# Altium schematic sheet Remote-control.SchDoc
size A4
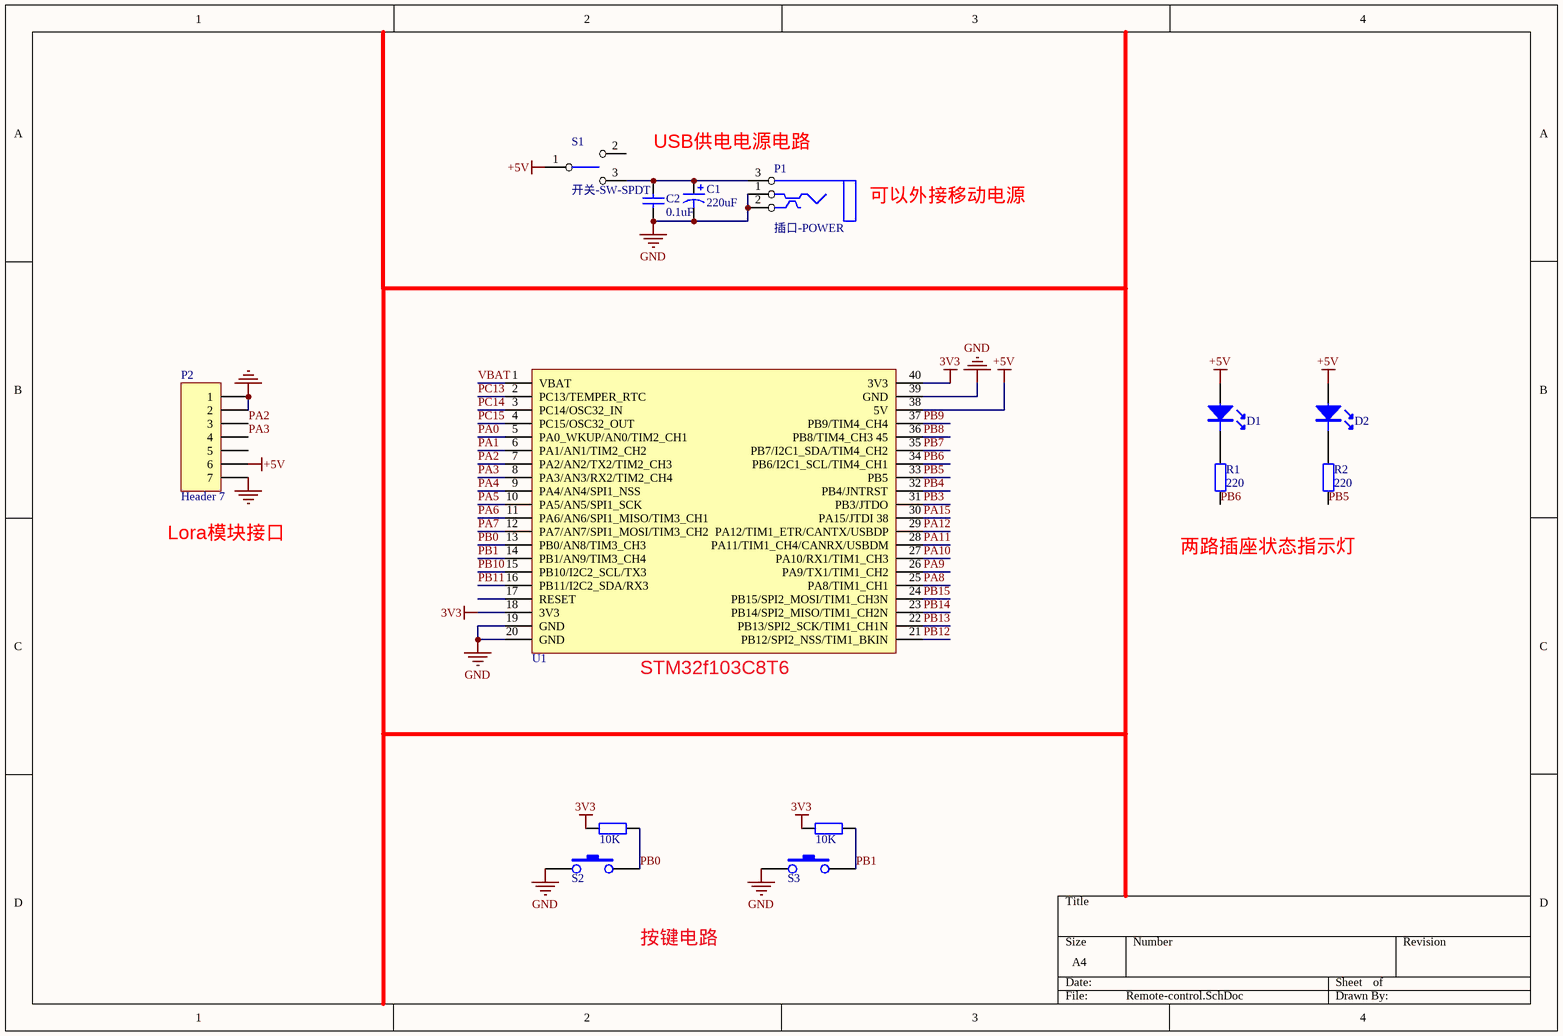
[diagram p0: Remote-control.SchDoc]

## Parts
C1  value 220uF  [cd0.254]  (hidden comment: Cap Pol1)
C2  value 0.1uF  [cc0.254]  (hidden comment: Cap)
D1  二极管--发光  [LED-5]  (value not drawn)
D2  二极管--发光  [LED-5]  (value not drawn)
P1  插口-POWER  [POW-DC]
P2  Header 7  [PE32(433T20DC)]
R1  value 220  [0805]  (hidden comment: Res2)
R2  value 220  [0805]  (hidden comment: Res2)
R3  value 10K  [AXIAL-0.4]  (hidden comment: Res2)
R4  value 10K  [AXIAL-0.4]  (hidden comment: Res2)
S1  开关-SW-SPDT  [SW3]
S2  开关-微动  [sw4/6]  (value not drawn)
S3  开关-微动  [sw4/6]  (value not drawn)
U1  Core_STM32_YX  [Core_STM32_YX]  (value not drawn)

## Nets
3V3: R3.2 R4.2 U1.18(3V3) U1.40(3V3)
+5V: D1.1 D2.1 P2.6 S1.1 U1.38(5V)
GND: C1.2 C2.1 P1.1 P1.2 P2.1 P2.2 P2.7 S2.1 S3.1 U1.19(GND) U1.20(GND) U1.39(GND)
PA0: U1.5(PA0_WKUP/AN0/TIM2_CH1)
PA1: U1.6(PA1/AN1/TIM2_CH2)
PA2: P2.3 U1.7(PA2/AN2/TX2/TIM2_CH3)
PA3: P2.4 U1.8(PA3/AN3/RX2/TIM2_CH4)
PA4: U1.9(PA4/AN4/SPI1_NSS)
PA5: U1.10(PA5/AN5/SPI1_SCK)
PA6: U1.11(PA6/AN6/SPI1_MISO/TIM3_CH1)
PA7: U1.12(PA7/AN7/SPI1_MOSI/TIM3_CH2)
PA8: U1.25(PA8/TIM1_CH1)
PA9: U1.26(PA9/TX1/TIM1_CH2)
PA10: U1.27(PA10/RX1/TIM1_CH3)
PA11: U1.28(PA11/TIM1_CH4/CANRX/USBDM)
PA12: U1.29(PA12/TIM1_ETR/CANTX/USBDP)
PA15: U1.30(PA15/JTDI_38)
PB0: R3.1 S2.2 U1.13(PB0/AN8/TIM3_CH3)
PB1: R4.1 S3.2 U1.14(PB1/AN9/TIM3_CH4)
PB3: U1.31(PB3/JTDO)
PB4: U1.32(PB4/JNTRST)
PB5: R2.2 U1.33(PB5)
PB6: R1.2 U1.34(PB6/I2C1_SCL/TIM4_CH1)
PB7: U1.35(PB7/I2C1_SDA/TIM4_CH2)
PB8: U1.36(PB8/TIM4_CH3_45)
PB9: U1.37(PB9/TIM4_CH4)
PB10: U1.15(PB10/I2C2_SCL/TX3)
PB11: U1.16(PB11/I2C2_SDA/RX3)
PB12: U1.21(PB12/SPI2_NSS/TIM1_BKIN)
PB13: U1.22(PB13/SPI2_SCK/TIM1_CH1N)
PB14: U1.23(PB14/SPI2_MISO/TIM1_CH2N)
PB15: U1.24(PB15/SPI2_MOSI/TIM1_CH3N)
PC13: U1.2(PC13/TEMPER_RTC)
PC14: U1.3(PC14/OSC32_IN)
PC15: U1.4(PC15/OSC32_OUT)
VBAT: U1.1(VBAT)
NetC1_1: C1.1 C2.2 P1.3 S1.3
NetD1_2: D1.2 R1.1
NetD2_2: D2.2 R2.1

Not connected (* = marked no-connect by the designer): P2 5; S1 2; U1 17(RESET)

## Notes on the sheet
- USB供电电源电路
- 可以外接移动电源
- (near P2) Lora模块接口
- (near R1) 两路插座状态指示灯
- (near U1) STM32f103C8T6
- 按键电路

## Library data of the parts
C1 = Cap Pol1: Polarized Capacitor (Radial); Published: 8-Jun-2000; LatestRevisionDate: 17-Jul-2002; LatestRevisionNote: Re-released for DXP Platform.; PackageReference: RB7.6-15; Publisher: Altium Limited
C2 = Cap: Capacitor; Published: 8-Jun-2000; LatestRevisionDate: 17-Jul-2002; LatestRevisionNote: Re-released for DXP Platform.; PackageReference: RAD-0.3; Publisher: Altium Limited
P2 = Header 7: Header, 7-Pin; LatestRevisionDate: 17-Jul-2002; LatestRevisionNote: Re-released for DXP Platform.; Publisher: Altium Limited
R1-R4 = Res2: Resistor; Published: 8-Jun-2000; LatestRevisionDate: 17-Jul-2002; LatestRevisionNote: Re-released for DXP Platform.; PackageReference: AXIAL-0.4; Publisher: Altium Limited